# Altium project PCB_Project2.PrjPCB
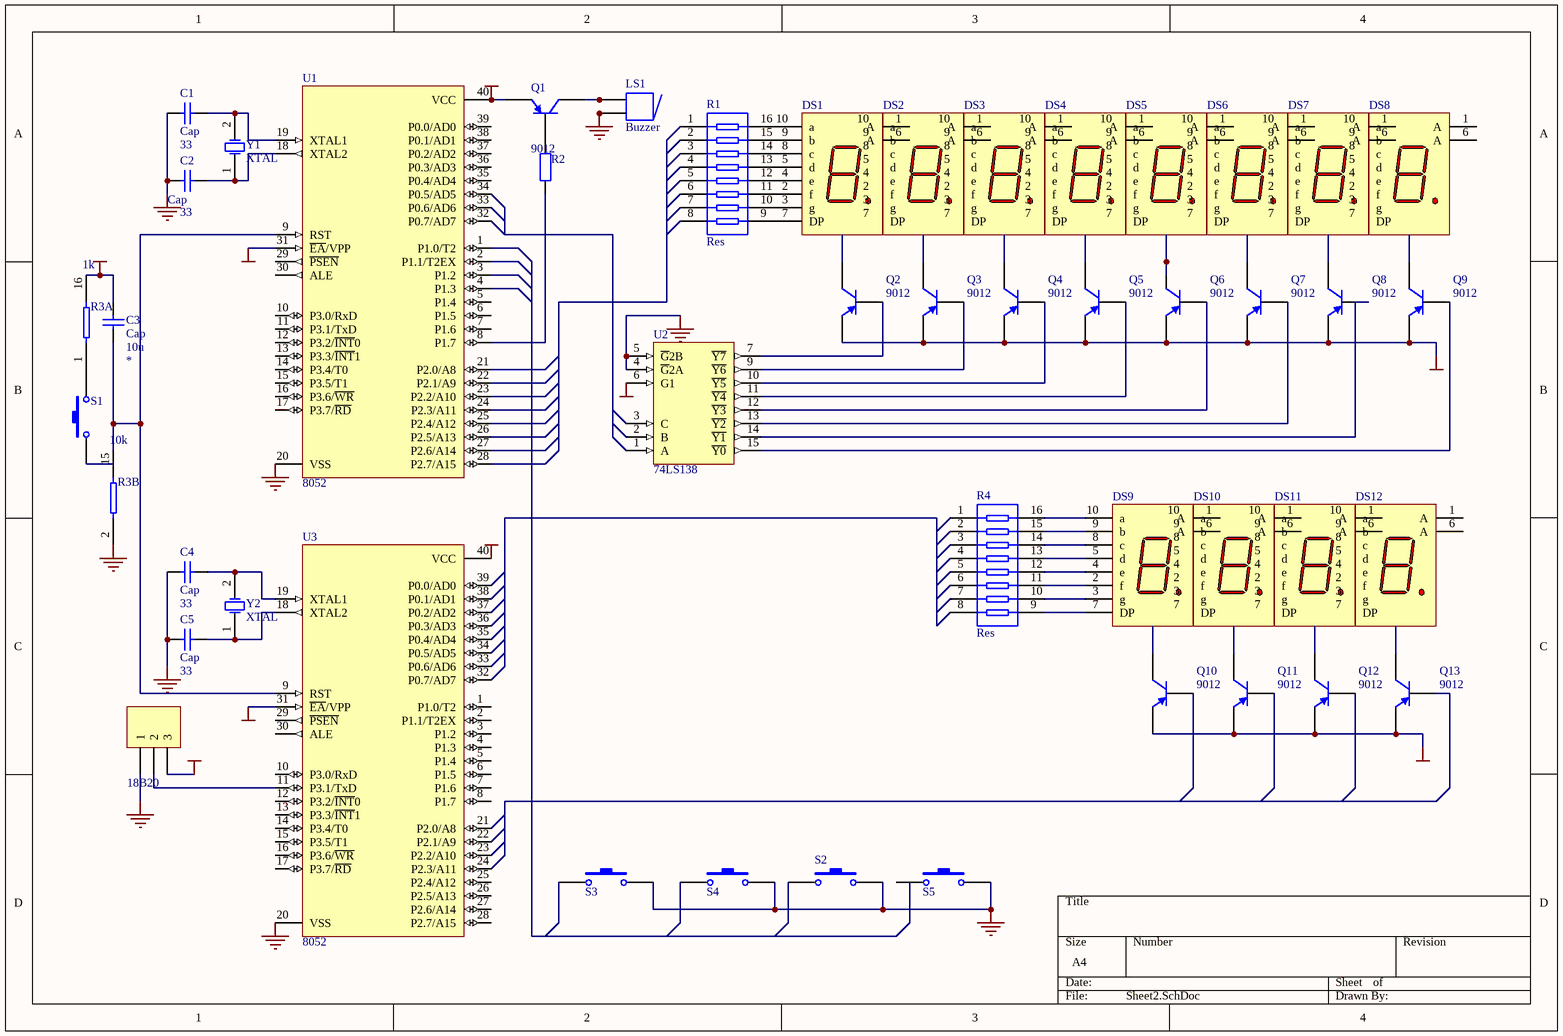
[diagram p0: Sheet2.SchDoc]
1 sheet, 46 parts. Net scope: global (net labels, ports and power ports of the same name join across sheets).

## Sheet Sheet2.SchDoc
size A4

### Parts
C1  Cap  [RAD-0.3]
C2  Cap  [RAD-0.3]
C3  Cap  [RAD-0.3]
C4  Cap  [RAD-0.3]
C5  Cap  [RAD-0.3]
DS1  Dpy Red-CA  [LEDDIP-10/C5.08RHD]  (value not drawn)
DS2  Dpy Red-CA  [LEDDIP-10/C5.08RHD]  (value not drawn)
DS3  Dpy Red-CA  [LEDDIP-10/C5.08RHD]  (value not drawn)
DS4  Dpy Red-CA  [LEDDIP-10/C5.08RHD]  (value not drawn)
DS5  Dpy Red-CA  [LEDDIP-10/C5.08RHD]  (value not drawn)
DS6  Dpy Red-CA  [LEDDIP-10/C5.08RHD]  (value not drawn)
DS7  Dpy Red-CA  [LEDDIP-10/C5.08RHD]  (value not drawn)
DS8  Dpy Red-CA  [LEDDIP-10/C5.08RHD]  (value not drawn)
DS9  Dpy Red-CA  [LEDDIP-10/C5.08RHD]  (value not drawn)
DS10  Dpy Red-CA  [LEDDIP-10/C5.08RHD]  (value not drawn)
DS11  Dpy Red-CA  [LEDDIP-10/C5.08RHD]  (value not drawn)
DS12  Dpy Red-CA  [LEDDIP-10/C5.08RHD]  (value not drawn)
LS1  Buzzer  [ABSM-1574]
P1  18B20  [HDR1X3]
Q1  9012  [BCY-W3/E4]
Q2  9012  [BCY-W3/E4]
Q3  9012  [BCY-W3/E4]
Q4  9012  [BCY-W3/E4]
Q5  9012  [BCY-W3/E4]
Q6  9012  [BCY-W3/E4]
Q7  9012  [BCY-W3/E4]
Q8  9012  [BCY-W3/E4]
Q9  9012  [BCY-W3/E4]
Q10  9012  [BCY-W3/E4]
Q11  9012  [BCY-W3/E4]
Q12  9012  [BCY-W3/E4]
Q13  9012  [BCY-W3/E4]
R1  Res  [SSO-G16/X.4]
R2  Res2  [AXIAL-0.4]  (value not drawn)
R3  Res Pack2  [DIP-16]  (value not drawn)  (parts A,B of 8)
R4  Res  [SSO-G16/X.4]
S1  SW-PB  [SPST-2]  (value not drawn)
S2  SW-PB  [SPST-2]  (value not drawn)
S3  SW-PB  [SPST-2]  (value not drawn)
S4  SW-PB  [SPST-2]  (value not drawn)
S5  SW-PB  [SPST-2]  (value not drawn)
U1  8052  [SOT129-1]
U2  74LS138  [DIP-16]
U3  8052  [SOT129-1]
Y1  XTAL  [BCY-W2/D3.1]
Y2  XTAL  [BCY-W2/D3.1]

### Nets
+5: P1.3 Q2.1(E) Q3.1(E) Q4.1(E) Q5.1(E) Q6.1(E) Q7.1(E) Q8.1(E) Q9.1(E) Q10.1(E) Q11.1(E) Q12.1(E) Q13.1(E) U2.6(G1)
+5v: C3.2 Q1.1(E) R3.16 U1.31(~{EA}/VPP) U1.40(VCC) U3.31(~{EA}/VPP) U3.40(VCC)
GND: C1.2 C2.2 C4.2 C5.2 LS1.1 LS1.1A P1.1 R3.2 S2.2 S3.2 S4.2 S5.2 U1.20(VSS) U2.4(~{G}2A) U2.5(~{G}2B) U2.8(GND) U3.20(VSS)
VCC: U2.16(VCC)
NetC1_1: C1.1 U1.19(XTAL1) Y1.2(OSC2)
NetC2_1: C2.1 U1.18(XTAL2) Y1.1(OSC1)
NetC3_1: C3.1 R3.15 U1.9(RST) U3.9(RST)
NetC4_1: C4.1 U3.19(XTAL1) Y2.2(OSC2)
NetC5_1: C5.1 U3.18(XTAL2) Y2.1(OSC1)
NetDS1_2: DS1.2(f) R1.11
NetDS1_3: DS1.3(g) R1.10
NetDS1_4: DS1.4(e) R1.12
NetDS1_5: DS1.5(d) R1.13
NetDS1_7: DS1.7(DP) R1.9
NetDS1_8: DS1.8(c) R1.14
NetDS1_9: DS1.9(b) R1.15
NetDS1_10: DS1.10(a) R1.16
NetDS9_2: DS9.2(f) R4.11
NetDS9_3: DS9.3(g) R4.10
NetDS9_4: DS9.4(e) R4.12
NetDS9_5: DS9.5(d) R4.13
NetDS9_7: DS9.7(DP) R4.9
NetDS9_8: DS9.8(c) R4.14
NetDS9_9: DS9.9(b) R4.15
NetDS9_10: DS9.10(a) R4.16
NetLS1_2: LS1.2 LS1.2A Q1.3(C)
NetP1_2: P1.2 U3.11(P3.1/TxD)
NetQ1_2: Q1.2(B) R2.2
NetQ2_2: Q2.2(B) U2.7(~{Y7})
NetQ3_2: Q3.2(B) U2.9(~{Y6})
NetQ4_2: Q4.2(B) U2.10(~{Y5})
NetQ5_2: Q5.2(B) U2.11(~{Y4})
NetQ6_2: Q6.2(B) U2.12(~{Y3})
NetQ7_2: Q7.2(B) U2.13(~{Y2})
NetQ8_2: Q8.2(B) U2.14(~{Y1})
NetQ9_2: Q9.2(B) U2.15(~{Y0})
NetR2_1: R2.1 U1.8(P1.7)
NetR3_1: R3.1 S1.2

Not connected (* = marked no-connect by the designer): DS1 1(A) 6(A); DS2 1(A) 2(f) 3(g) 4(e) 5(d) 6(A) 7(DP) 8(c) 9(b) 10(a); DS3 1(A) 2(f) 3(g) 4(e) 5(d) 6(A) 7(DP) 8(c) 9(b) 10(a); DS4 1(A) 2(f) 3(g) 4(e) 5(d) 6(A) 7(DP) 8(c) 9(b) 10(a); DS5 1(A) 2(f) 3(g) 4(e) 5(d) 6(A) 7(DP) 8(c) 9(b) 10(a); DS6 1(A) 2(f) 3(g) 4(e) 5(d) 6(A) 7(DP) 8(c) 9(b) 10(a); DS7 1(A) 2(f) 3(g) 4(e) 5(d) 6(A) 7(DP) 8(c) 9(b) 10(a); DS8 1(A) 2(f) 3(g) 4(e) 5(d) 6(A) 7(DP) 8(c) 9(b) 10(a); DS9 1(A) 6(A); DS10 1(A) 2(f) 3(g) 4(e) 5(d) 6(A) 7(DP) 8(c) 9(b) 10(a); DS11 1(A) 2(f) 3(g) 4(e) 5(d) 6(A) 7(DP) 8(c) 9(b) 10(a); DS12 1(A) 2(f) 3(g) 4(e) 5(d) 6(A) 7(DP) 8(c) 9(b) 10(a); Q2 3(C); Q3 3(C); Q4 3(C); Q5 3(C); Q6 3(C); Q7 3(C); Q8 3(C); Q9 3(C); Q10 2(B) 3(C); Q11 2(B) 3(C); Q12 2(B) 3(C); Q13 2(B) 3(C); R1 1 2 3 4 5 6 7 8; R4 1 2 3 4 5 6 7 8; S1 1; S2 1; S3 1; S4 1; S5 1; U1 1(P1.0/T2) 2(P1.1/T2EX) 3(P1.2) 4(P1.3) 5(P1.4) 6(P1.5) 7(P1.6) 10(P3.0/RxD) 11(P3.1/TxD) 12(P3.2/~{INT}0) 13(P3.3/~{INT}1) 14(P3.4/T0) 15(P3.5/T1) 16(P3.6/~{WR}) 17(P3.7/~{RD}) 21(P2.0/A8) 22(P2.1/A9) 23(P2.2/A10) 24(P2.3/A11) 25(P2.4/A12) 26(P2.5/A13) 27(P2.6/A14) 28(P2.7/A15) 29(~{PSEN}) 30(ALE) 32(P0.7/AD7) 33(P0.6/AD6) 34(P0.5/AD5) 35(P0.4/AD4) 36(P0.3/AD3) 37(P0.2/AD2) 38(P0.1/AD1) 39(P0.0/AD0); U2 1(A) 2(B) 3(C); U3 1(P1.0/T2) 2(P1.1/T2EX) 3(P1.2) 4(P1.3) 5(P1.4) 6(P1.5) 7(P1.6) 8(P1.7) 10(P3.0/RxD) 12(P3.2/~{INT}0) 13(P3.3/~{INT}1) 14(P3.4/T0) 15(P3.5/T1) 16(P3.6/~{WR}) 17(P3.7/~{RD}) 21(P2.0/A8) 22(P2.1/A9) 23(P2.2/A10) 24(P2.3/A11) 25(P2.4/A12) 26(P2.5/A13) 27(P2.6/A14) 28(P2.7/A15) 29(~{PSEN}) 30(ALE) 32(P0.7/AD7) 33(P0.6/AD6) 34(P0.5/AD5) 35(P0.4/AD4) 36(P0.3/AD3) 37(P0.2/AD2) 38(P0.1/AD1) 39(P0.0/AD0)

### Notes on the sheet
- (in symbol Cap) 33; 10u
- (in symbol Res Pack2, part A) 1k
- (in symbol Res Pack2, part B) 10k

### Library data of the parts
C1-C5 = Cap: Capacitor; Published: 8-Jun-2000; LatestRevisionDate: 17-Jul-2002; LatestRevisionNote: Re-released for DXP Platform.; Publisher: Altium Limited
DS1-DS12 = Dpy Red-CA: 7.62 mm Black Surface HER 7-Segment Display: CA, RH DP; MinimumIntensity: 360 ucd; Note: IF = 5 mA; Colour: High Efficiency Red (HER); Note: Pins 1 and 6 are redundant Anodes.; Published: 8-Jun-2000; LatestRevisionDate: 17-Dec-2003; LatestRevisionNote: Schematic revised, PCB Footprint replaced.; DatasheetDocument: ##########; PackageDocument: 19-Feb-2002; PackageReference: A; Publisher: Altium Limited; ComponentLink1Description: Manufacturer Link; ComponentLink1URL: http://www.semiconductor.agilent.com/
LS1 = Buzzer: Magnetic Transducer Buzzer; Published: 24-Mar-1999; LatestRevisionDate: 17-Dec-2003; LatestRevisionNote: Schematic revised, PCB Footprint replaced.; DatasheetDocument: ##########; Publisher: Altium Limited; ComponentLink1Description: Manufacturer Link; ComponentLink1URL: http://www.megastar.com/linecard/buzzmode/index.php
P1 = Header 3: Header, 3-Pin; LatestRevisionDate: 17-Jul-2002; LatestRevisionNote: Re-released for DXP Platform.; Publisher: Altium Limited
Q1-Q13 = 2N3906: PNP General Purpose Amplifier; Published: 8-Jun-2000; LatestRevisionDate: 15-Jan-2003; LatestRevisionNote: PCB Footprint 'BCY-W3/D4.7' replaced; DatasheetDocument: 1997; PackageDocument: Sep-1998; PackageReference: TO-92A; Publisher: Altium Limited; Code_JEDEC: TO-92A
R1 R4 = Res Pack4: Isolated Resistor Network; Published: 24-Mar-1999; LatestRevisionDate: 17-Jul-2002; LatestRevisionNote: Re-released for DXP Platform.; Publisher: Altium Limited; Code_JEDEC: MO-150-AC
R2 = Res2: Resistor; Published: 8-Jun-2000; LatestRevisionDate: 17-Jul-2002; LatestRevisionNote: Re-released for DXP Platform.; Publisher: Altium Limited
R3 = Res Pack2: Isolated Resistor Network - Parts; Sim Note: Enter the Resistance value into parameter field.; Published: 24-Mar-1999; LatestRevisionDate: 17-Jul-2002; LatestRevisionNote: Re-released for DXP Platform.; Publisher: Altium Limited; Code_JEDEC: MO-001-AC
S1-S5 = SW-PB: Switch; Published: 24-Mar-1999; LatestRevisionDate: 17-Jul-2002; LatestRevisionNote: Re-released for DXP Platform.; Publisher: Altium Limited
U1 U3 = P80C31SBPN: 80C51 8-Bit Microcontroller Family: 128 B RAM, ROMless, 2.7 V-5.5 V, Low Power, High Speed; Published: 21-May-2003; DatasheetDocument: 7-Aug-2000; PackageDocument: 07-Aug-2000; PackageReference: SOT129-1; Publisher: Altium Limited; ComponentLink1Description: Manufacturer Link; ComponentLink1URL: http://www-us2.semiconductors.philips.com/; Code_JEDEC: MO-015
U2 = 74LS138: 3-Line to 8-Line Decoder/Demultiplexer
Y1 Y2 = XTAL: Crystal Oscillator; Published: 8-Jun-2000; LatestRevisionDate: 17-Jul-2002; LatestRevisionNote: Re-released for DXP Platform.; PackageReference: R38; Publisher: Altium Limited